# Altium schematic sheet 01_ Title Page.SchDoc: EFR32FG28 Diversity Board with discrete matching network for 868/915 MHz
size 420 x 297 mm; Rev3: 3; Dscr4A: g; Dscr8A: o; Dscr6A: k; Board Designer: MSZ; Dscr9A: q; RevCode: A00; Rev1: A00; Dscr3A: e; Header A: EFR32FG28 Diversity Board with discrete matching network for 868/915 MHz; Dscr9B: r; Rev8: 8; Rev5: 5; Page Number: 1; Page Size: A3; Rev6: 6; Page Count: 4; Rev9: 9; Dscr1A: Initial production release.; Doc: BRD4210C; OrgName: Silicon Labs; Dscr5B: j; Dscr7B: n; Rev7: 7; Dscr6B: l; Dscr2A: Updated U1 OPN.; Dscr7A: m; Rev4: 4; Dscr4B: h; Rev2: A00; Dscr3B: f; Dscr1B: b; Dscr8B: p; Page Title: Title Page; Dscr5A: i; Dscr2B: d; DsnPath: C:\Users\maszvobo\Downloads\BRD4210A-A01-schematic-dsn\BRD4210A.DSN; SchematicName: SCHEMATIC1; PageName: 01: Title Page; PageSize: A3; TopSchematic: True
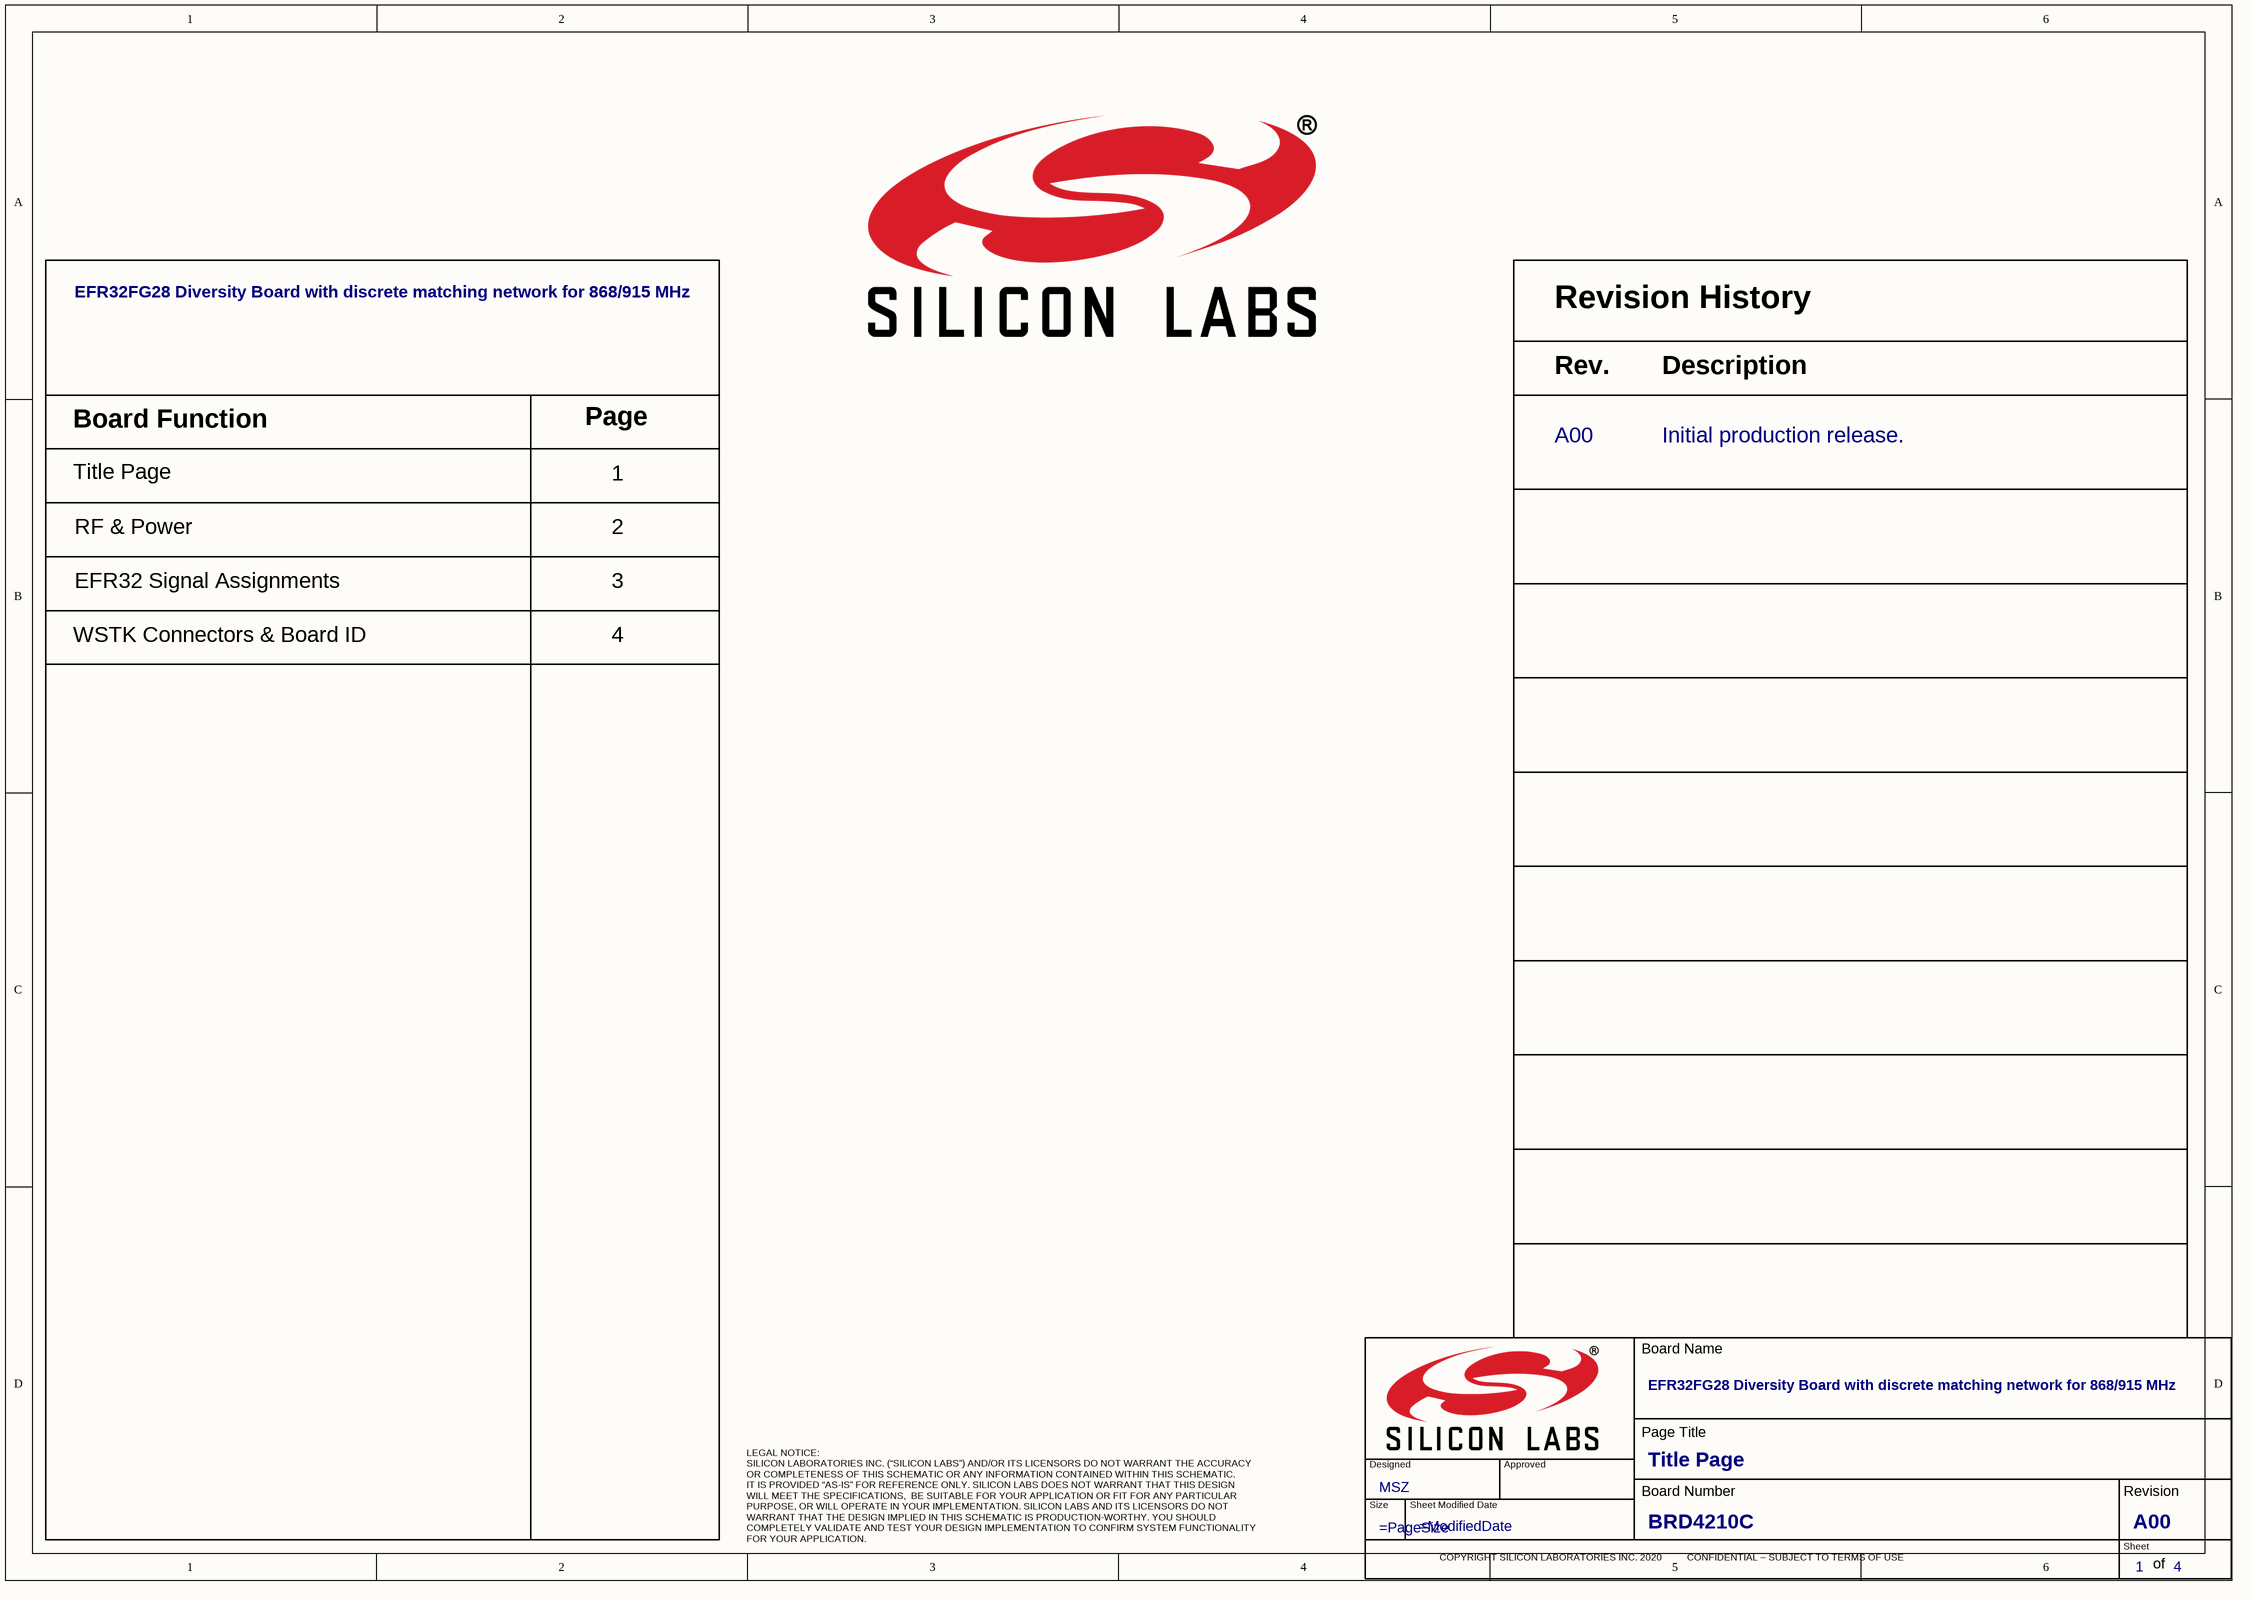
[diagram p0: 01_ Title Page.SchDoc]

## Parts
(Parts that share a designator on the sheet are numbered #1, #2 ... from top to bottom, then left to right.)
*#1  Header A: EFR32FG28 Diversity Board with discrete matching network for 868/915 MHz  (graphical)
*#2  Dscr1A: Initial production release.  Rev1: A00  (graphical)
*#3  Doc: BRD4210C  RevCode: A00  Board Designer: MSZ  Page Title: Title Page  Page Number: 1  Page Count: 4  Title: EFR32FG28 Diversity Board with discrete matching network for 868/915 MHz  (graphical)

## Notes on the sheet
- Board Function
- Page
- Title Page
- 1
- RF & Power
- EFR32 Signal Assignments
- 2
- 3
- WSTK Connectors & Board ID
- 4
- LEGAL NOTICE:
  SILICON LABORATORIES INC. (“SILICON LABS”) AND/OR ITS LICENSORS DO NOT WARRANT THE ACCURACY
  OR COMPLETENESS OF THIS SCHEMATIC OR ANY INFORMATION CONTAINED WITHIN THIS SCHEMATIC.
  IT IS PROVIDED “AS-IS” FOR REFERENCE ONLY. SILICON LABS DOES NOT WARRANT THAT THIS DESIGN
  WILL MEET THE SPECIFICATIONS,  BE SUITABLE FOR YOUR APPLICATION OR FIT FOR ANY PARTICULAR
  PURPOSE, OR WILL OPERATE IN YOUR IMPLEMENTATION. SILICON LABS AND ITS LICENSORS DO NOT
  WARRANT THAT THE DESIGN IMPLIED IN THIS SCHEMATIC IS PRODUCTION-WORTHY. YOU SHOULD
  COMPLETELY VALIDATE AND TEST YOUR DESIGN IMPLEMENTATION TO CONFIRM SYSTEM FUNCTIONALITY
  FOR YOUR APPLICATION.
- (in symbol Rev_History) Revision History; Rev.; Description
- (in symbol TitleBlock_SiliconLabs_A3) Board Name; Page Title; Designed; Approved; Board Number; Revision; Size; Sheet Modified Date; Sheet; COPYRIGHT SILICON LABORATORIES INC. 2020          CONFIDENTIAL – SUBJECT TO TERMS OF USE; of

## Library data of the parts
*#1 = Toc_Header
*#2 = Rev_History: Dscr4B: h; Dscr5B: j; Dscr4A: g; Dscr6B: l; Dscr5A: i; Dscr7B: n; Dscr6A: k; Dscr8B: p; Dscr7A: m; Dscr9B: r; Dscr8A: o; Dscr9A: q; Dscr1B: b; Dscr2B: d; Dscr3B: f; Dscr3A: e; Rev9: 9; Rev8: 8; Rev7: 7; Rev6: 6; Rev5: 5; Rev4: 4; Rev3: 3; RevCode: A00
*#3 = TitleBlock_SiliconLabs_A3: Page Size: =PageSize; Page Modify Date: =ModifiedDate; OrgName: Silicon Labs